# Altium schematic sheet Teensy32.SchDoc: Micro-Computer Controls
size Letter; DocumentNumber: 1; Revision: 1; SheetNumber: 1; SheetTotal: 6
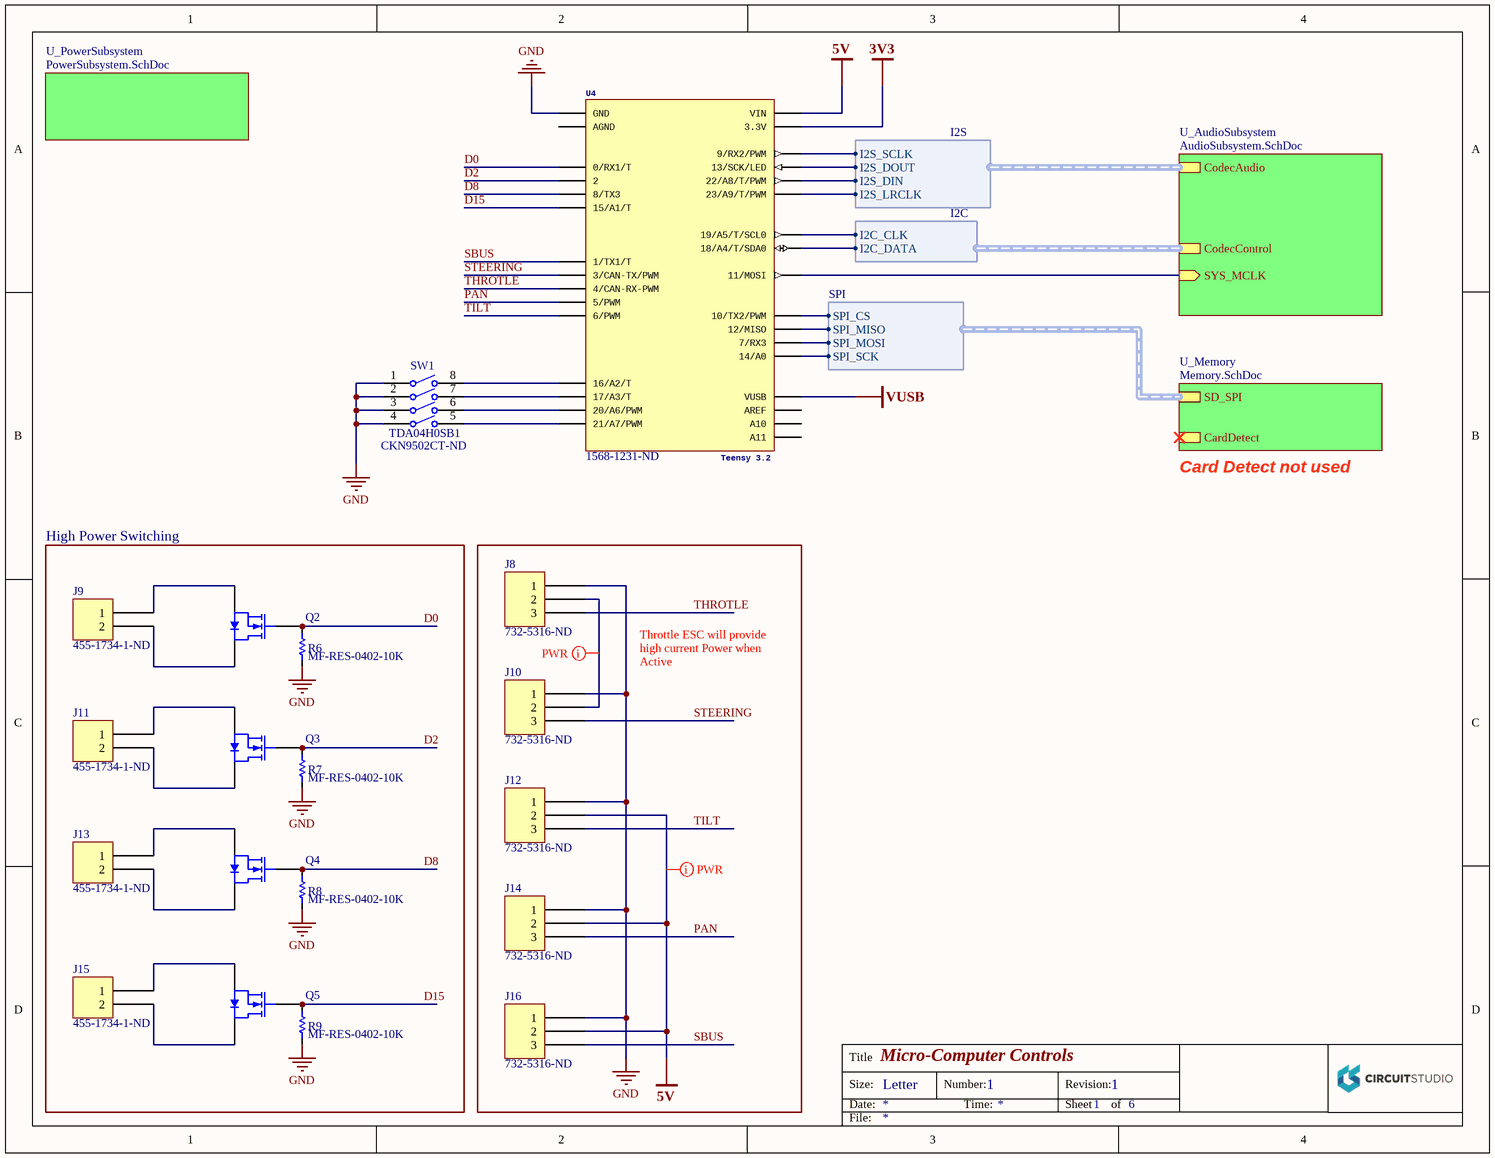
[diagram p0: Teensy32.SchDoc]

## Parts
J8  Supplier Part Number 1: 732-5316-ND  [Pinhead_1x3]  (hidden comment: Header)
J9  455-1734-1-ND  [JST B2B-PH-SM4]
J10  Supplier Part Number 1: 732-5316-ND  [Pinhead_1x3]  (hidden comment: Header)
J11  455-1734-1-ND  [JST B2B-PH-SM4]
J12  Supplier Part Number 1: 732-5316-ND  [Pinhead_1x3]  (hidden comment: Header)
J13  455-1734-1-ND  [JST B2B-PH-SM4]
J14  Supplier Part Number 1: 732-5316-ND  [Pinhead_1x3]  (hidden comment: Header)
J15  455-1734-1-ND  [JST B2B-PH-SM4]
J16  Supplier Part Number 1: 732-5316-ND  [Pinhead_1x3]  (hidden comment: Header)
Q2  MOSFET N-Ch  [TO-220]  (value not drawn)
Q3  MOSFET N-Ch  [TO-220]  (value not drawn)
Q4  MOSFET N-Ch  [TO-220]  (value not drawn)
Q5  MOSFET N-Ch  [TO-220]  (value not drawn)
R6  MF-RES-0402-10K  [R0402L]
R7  MF-RES-0402-10K  [R0402L]
R8  MF-RES-0402-10K  [R0402L]
R9  MF-RES-0402-10K  [R0402L]
SW1  TDA04H0SB1  Supplier Part Number 1: CKN9502CT-ND  [CKCP-TDA04H0SB1R_V]
U4  Teensy 3.2  Supplier Part Number 1: 1568-1231-ND  [TEENSY_3.0-3.2&LC_SMD+4]

## Blocks framed on the sheet
High Power Switching: J9 J11 J13 J15 Q2-Q5 R6-R9

## Sub-sheets
U_AudioSubsystem = AudioSubsystem.SchDoc: SYS_MCLK (in), CodecControl (harness I2C), CodecAudio (harness I2S)
U_Memory = Memory.SchDoc: SD_SPI (harness SPI), CardDetect
U_PowerSubsystem = PowerSubsystem.SchDoc: no entries

## Harnesses
I2S: I2S_DIN, I2S_DOUT, I2S_LRCLK, I2S_SCLK
I2C: I2C_CLK, I2C_DATA
SPI: SPI_CS, SPI_MISO, SPI_MOSI, SPI_SCK

## Nets
3V3: U4.3.3V
5V: J12.2 J14.2 J16.2 U4.VIN
GND: J8.1 J10.1 J12.1 J14.1 J16.1 R6.2 R7.2 R8.2 R9.2 SW1.1 SW1.2 SW1.3 SW1.4 U4.GND
VUSB: U4.VUSB
D0: Q2.1(G) R6.1 U4.0(0/RX1/T)
D2: Q3.1(G) R7.1 U4.2
D8: Q4.1(G) R8.1 U4.8(8/TX3)
D15: Q5.1(G) R9.1 U4.15/A1(15/A1/T)
PAN: J14.3 U4.5(5/PWM)
SBUS: J16.3 U4.1(1/TX1/T)
STEERING: J10.3 U4.3(3/CAN-TX/PWM)
THROTLE: J8.3 U4.4(4/CAN-RX-PWM)
TILT: J12.3 U4.6(6/PWM)
NetJ8_2: J8.2 J10.2
NetJ9_1: J9.1 Q2.3(S)
NetJ9_2: J9.2 Q2.2(D)
NetJ11_1: J11.1 Q3.3(S)
NetJ11_2: J11.2 Q3.2(D)
NetJ13_1: J13.1 Q4.3(S)
NetJ13_2: J13.2 Q4.2(D)
NetJ15_1: J15.1 Q5.3(S)
NetJ15_2: J15.2 Q5.2(D)
NetSW1_5: SW1.5 U4.21/A7(21/A7/PWM)
NetSW1_6: SW1.6 U4.20/A6(20/A6/PWM)
NetSW1_7: SW1.7 U4.17/A3(17/A3/T)
NetSW1_8: SW1.8 U4.16/A2(16/A2/T)
NetU4_7: U4.7(7/RX3) ; sheet U_Memory/SD_SPI.SPI_MOSI
NetU4_9: U4.9(9/RX2/PWM) ; sheet U_AudioSubsystem/CodecAudio.I2S_SCLK
NetU4_10: U4.10(10/TX2/PWM) ; sheet U_Memory/SD_SPI.SPI_CS
NetU4_11: U4.11(11/MOSI) ; sheet U_AudioSubsystem/SYS_MCLK
NetU4_12: U4.12(12/MISO) ; sheet U_Memory/SD_SPI.SPI_MISO
NetU4_13: U4.13(13/SCK/LED) ; sheet U_AudioSubsystem/CodecAudio.I2S_DOUT
NetU4_14/A0: U4.14/A0 ; sheet U_Memory/SD_SPI.SPI_SCK
NetU4_18/A4: U4.18/A4(18/A4/T/SDA0) ; sheet U_AudioSubsystem/CodecControl.I2C_DATA
NetU4_19/A5: U4.19/A5(19/A5/T/SCL0) ; sheet U_AudioSubsystem/CodecControl.I2C_CLK
NetU4_22/A8: U4.22/A8(22/A8/T/PWM) ; sheet U_AudioSubsystem/CodecAudio.I2S_DIN
NetU4_23/A9: U4.23/A9(23/A9/T/PWM) ; sheet U_AudioSubsystem/CodecAudio.I2S_LRCLK

Not connected (* = marked no-connect by the designer): U4 A10 A11 AGND AREF

## Layout directives
net class PWR: 5V, NetJ8_2

## Notes on the sheet
- Card Detect not used
- Throttle ESC will provide high current Power when Active
- Title
- Size:
- Date:
- Letter
- Number:
- Time:
- Revision:
- Sheet
- of
- File:

## Library data of the parts
J8 J10 J12 J14 J16 = 3 Pin: Supplier 1: Digi-Key
J9 J11 J13 J15 = 2 Pin: Supplier 1: Digi-Key; Supplier Part Number 1: 455-1734-1-ND
R6-R9 = RESISTOR: HOUSEPART: YES; POPULATE: 1; TOLERANCE: 5%; VOLTAGE: 50V; WATTAGE: 100mW; VALUE: 10K; SymbolName_1: RESISTOR; LibraryName: MF_Passives; DeviceSetName: RESISTOR; MF_PARTNUM: MF-RES-0402-10K
SW1 = CMP-1727-00001-1: Ultra-Miniature Surface Mount Half-Pitch DIP Switch, 25 mA, 24 V, -40 to 85 degC, 8-Pin SMD, RoHS, Tube; Contact Current Rating: 100 mA; Throw Configuration: SPST; Voltage Rating (DC): 24 V; Max Contact Resistance: 100 mohm; Max Current Rating: 25 mA; REACH SVHC: No SVHC; DatasheetVersion: 02/2016; Case\Package: DIP; Package Quantity: 70; Lead Pitch: 1.27 mm; Contact Plating: Gold; Packaging: Rail/Tube; Contact Finish: Gold; Mount: Surface Mount; Height: 2.3 mm; Contact Material: Copper; Max Operating Temperature: 85 degC; Max Voltage Rating (DC): 24 V; ComponentLink1URL: http://www.ck-components.com/media/1328/tda.pdf; PackageDescription: 8-Pin Surface Mount Device, Body 6.21 x 6.2 mm, Pitch 1.27 mm; Radiation Hardening: No; ComponentLink1Description: Datasheet; Current Rating: 100 mA; RoHSCompliant: true; PackageReference: TDA04H0SB1R; Min Operating Temperature: -40 degC; Pins: 4; Mounting Technology: Surface Mount; Length: 6.21 mm; Supplier 1: Digi-Key
U4 = TEENSY 3.2 + 4: Teensy 3.2 /w 4 inner pins; Processor: MK20DX256VLH7; Clock Speed: 72MHz; Flash: 256 kb; RAM: 64 kb; DMA Channels: 4; USB: Yes; ADCs: 2; DeviceName: Teensy 3.2; URL: https://www.pjrc.com/teensy/teensy31.html; Supplier 1: Digi-Key
Q2-Q5 = MOSFET N-Ch: MF_PARTNUM: *; HOUSEPART: *; POPULATE: *; MPN: *; Mounting Technology: *; Package Description: *; Continous Drain Current (Id): *; Drain-Source Voltage (Vds): *; Gate-Source Votlage (Vgs): *; Power Dissapation (Pd): *; Supplier 1: Digi-Key; Supplier Part Number 1: FQP30N06L-ND